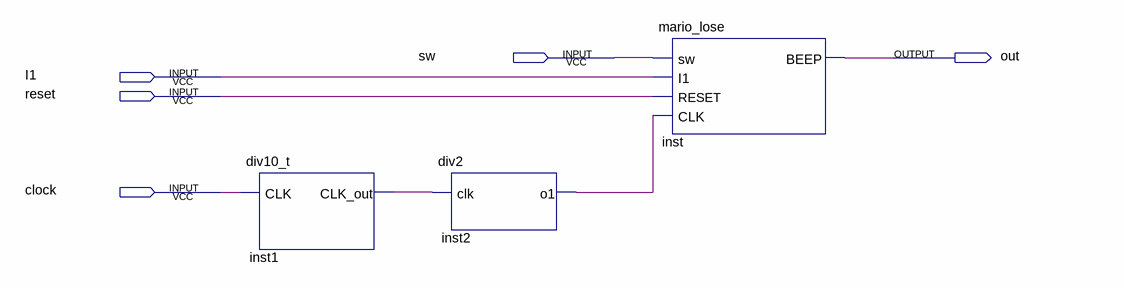
[diagram p0: schematic sheet]
// Quartus schematic mario_lose_test.bdf as structural Verilog: 3 symbols, 5 pins
module mario_lose_test (
  input  sw,
  input  I1,
  input  reset,
  input  clock,
  output out
);

  wire inst1_clk_out, inst2_o1;

  div10_t inst1 (.CLK(clock), .CLK_out(inst1_clk_out));
  div2 inst2 (.clk(inst1_clk_out), .o1(inst2_o1));
  mario_lose inst (.sw(sw), .I1(I1), .RESET(reset), .CLK(inst2_o1), .BEEP(out));
endmodule
